# Altium schematic sheet fpga.SchDoc
size A4
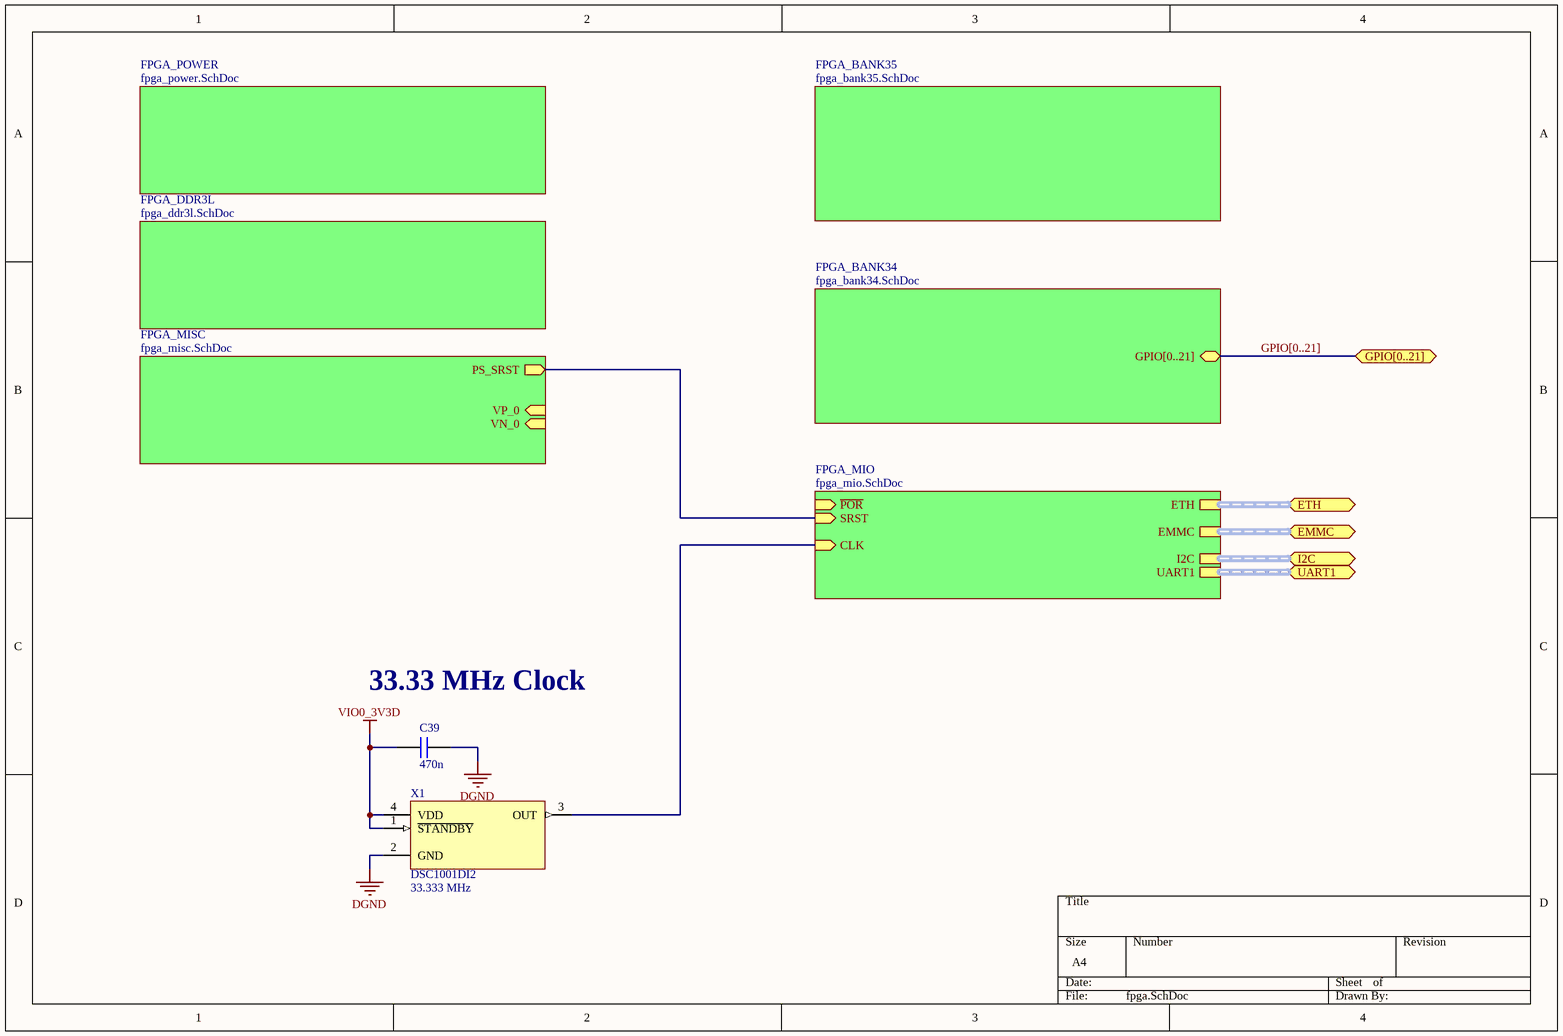
[diagram p0: fpga.SchDoc]

## Parts
C39  value 470n  [CAPC1608X08N]  (hidden comment: cap)
X1  DSC1001DI2  Frequency: 33.333 MHz  [DFN165P200X90-4N_DSC1001DIx]

## Sub-sheets
FPGA_BANK34 = fpga_bank34.SchDoc: GPIO[0..21] (bidir)
FPGA_BANK35 = fpga_bank35.SchDoc: no entries
FPGA_DDR3L = fpga_ddr3l.SchDoc: no entries
FPGA_MIO = fpga_mio.SchDoc: UART1 (harness SERIAL), ~{POR} (in), CLK (in), EMMC (harness SDCARD), I2C (harness I2C), SRST (in), ETH (harness ETHERNET)
FPGA_MISC = fpga_misc.SchDoc: VP_0 (in), VN_0 (in), PS_SRST (out)
FPGA_POWER = fpga_power.SchDoc: no entries

## Ports
EMMC (bidir), ETH (bidir), GPIO[0..21] (bidir), I2C (bidir), UART1 (bidir)

## Nets
DGND: C39.1 X1.2(GND)
VIO0_3V3D: C39.2 X1.1(~{STANDBY}) X1.4(VDD)
NetX1_3: X1.3(OUT) ; sheet FPGA_MIO/CLK
(unnamed): sheet FPGA_MISC/PS_SRST, sheet FPGA_MIO/SRST

## Buses and harness runs
bus GPIO[0..21] = port GPIO[0..21] = sheet FPGA_BANK34/GPIO[0..21]
harness port EMMC = sheet FPGA_MIO/EMMC
harness port ETH = sheet FPGA_MIO/ETH
harness port I2C = sheet FPGA_MIO/I2C
harness port UART1 = sheet FPGA_MIO/UART1

## Notes on the sheet
- (near C39) 33.33 MHz Clock

## Library data of the parts
C39 = cap: Capacitor; voltage: *; type: *; #digikey: *; #mouser: *
X1 = dsc1001dix: 1.8V-3.3V Low-Power Precision CMOS Oscillators